# Altium schematic sheet HAL_3.SchDoc
size A
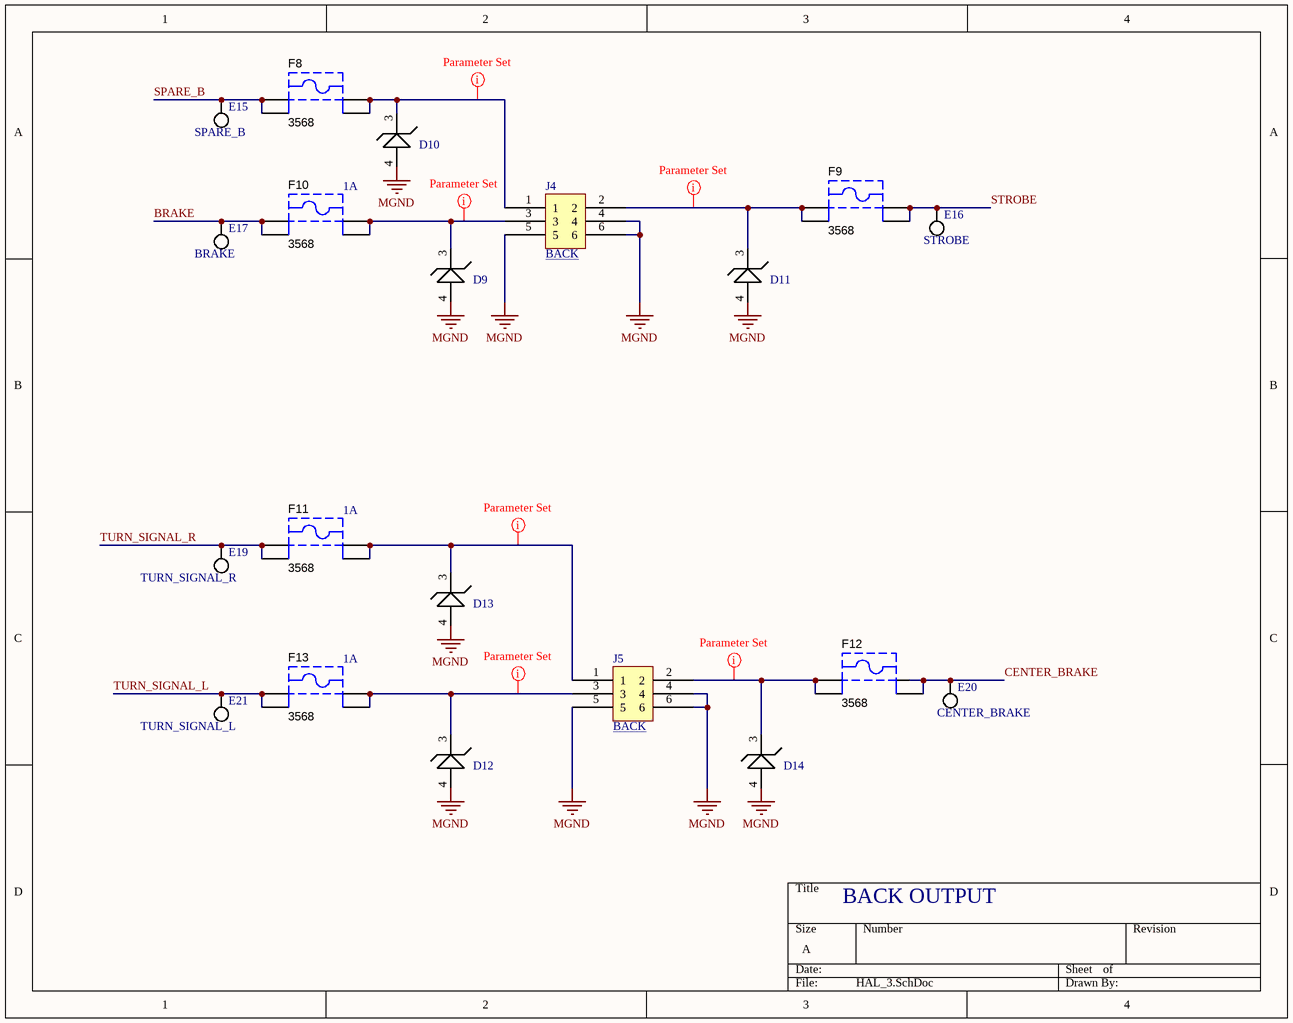
[diagram p0: HAL_3.SchDoc]

## Parts
D9  TVS DIODE 12.4V 20.1V DO219AB  [TVS DIODE 12.4V 20.1V DO219AB]  (value not drawn)
D10  TVS DIODE 12.4V 20.1V DO219AB  [TVS DIODE 12.4V 20.1V DO219AB]  (value not drawn)
D11  TVS DIODE 12.4V 20.1V DO219AB  [TVS DIODE 12.4V 20.1V DO219AB]  (value not drawn)
D12  TVS DIODE 12.4V 20.1V DO219AB  [TVS DIODE 12.4V 20.1V DO219AB]  (value not drawn)
D13  TVS DIODE 12.4V 20.1V DO219AB  [TVS DIODE 12.4V 20.1V DO219AB]  (value not drawn)
D14  TVS DIODE 12.4V 20.1V DO219AB  [TVS DIODE 12.4V 20.1V DO219AB]  (value not drawn)
E15  SPARE_B  [EPAD]  (no BOM)
E16  STROBE  [EPAD]  (no BOM)
E17  BRAKE  [EPAD]  (no BOM)
E19  TURN_SIGNAL_R  [EPAD]  (no BOM)
E20  CENTER_BRAKE  [EPAD]  (no BOM)
E21  TURN_SIGNAL_L  [EPAD]  (no BOM)
F8  3568  [KSTN-3568_V]
F9  3568  [KSTN-3568_V]
F10  3568  [KSTN-3568_V]
F11  3568  [KSTN-3568_V]
F12  3568  [KSTN-3568_V]
F13  3568  [KSTN-3568_V]
J4  BACK  [PCBComponent_1 - duplicate]
J5  BACK  [PCBComponent_1 - duplicate]

## Nets
MGND: D9.4 D10.4 D11.4 D12.4 D13.4 D14.4 J4.4 J4.5 J4.6 J5.4 J5.5 J5.6
BRAKE: E17.1 F10.1 F10.2
CENTER_BRAKE: E20.1 F12.3 F12.4
SPARE_B: E15.1 F8.1 F8.2
STROBE: E16.1 F9.3 F9.4
TURN_SIGNAL_L: E21.1 F13.1 F13.2
TURN_SIGNAL_R: E19.1 F11.1 F11.2
NetD9_3: D9.3 F10.3 F10.4 J4.3
NetD10_3: D10.3 F8.3 F8.4 J4.1
NetD11_3: D11.3 F9.1 F9.2 J4.2
NetD12_3: D12.3 F13.3 F13.4 J5.3
NetD13_3: D13.3 F11.3 F11.4 J5.1
NetD14_3: D14.3 F12.1 F12.2 J5.2

## Layout directives
rule Width Constraint [Pref Width = 70mil    Min Width = 70mil    Max Width = 70mil]: NetD9_3, NetD10_3, NetD11_3, NetD12_3, NetD13_3, NetD14_3

## Notes on the sheet
- (near F10) 1A
- (near F11) 1A
- (near F13) 1A
- BACK OUTPUT

## Library data of the parts
E15-E17 E19-E21 = EPAD: Pad for probing signals
F8-F13 = CMP-2000-05464-1: Fuse Holder, 20 A, 500 V, -50 to 145 degC, 4-Pin THD, RoHS; Manufacturer: Keystone; Package Reference: 3568; Datasheet Version: 04/2013; Datasheet URL: https://datasheet.ciiva.com/16294/m60-2p40-16294706.pdf; Manufacturer URL: http://www.keyelco.com/; Mounting Technology: ThroughHole; Package Description: 4-Pin Through Hole Device, Body 16 x 6.73 mm, Pitch 9.9 mm
J4 J5 = 6 pin Megafit: 768250006-https://www.digikey.com/en/products/detail/molex/0768250006/5639613?s=N4IgTCBcDaIOwDYAcYCsAGTCQF0C%2BQA; ComponentLink1Description: New link; ComponentLink1URL: *https://www.digikey.com/en/products/detail/molex/0768250006/5639613?s=N4IgTCBcDaIOwDYAcYCsAGTCQF0C%2BQA
D9-D14 = TVS DIODE 12.4V 20.1V DO219AB: ComponentLink1Description: Digikey; ComponentLink1URL: https://www.digikey.com/product-detail/en/vishay-semiconductor-diodes-division/VTVS12ASMF-M3-08/112-VTVS12ASMF-M3-08CT-ND/7055981; ComponentLink2Description: Datasheet; ComponentLink2URL: http://www.vishay.com/docs/85891/vtvs3v3asmf.pdf